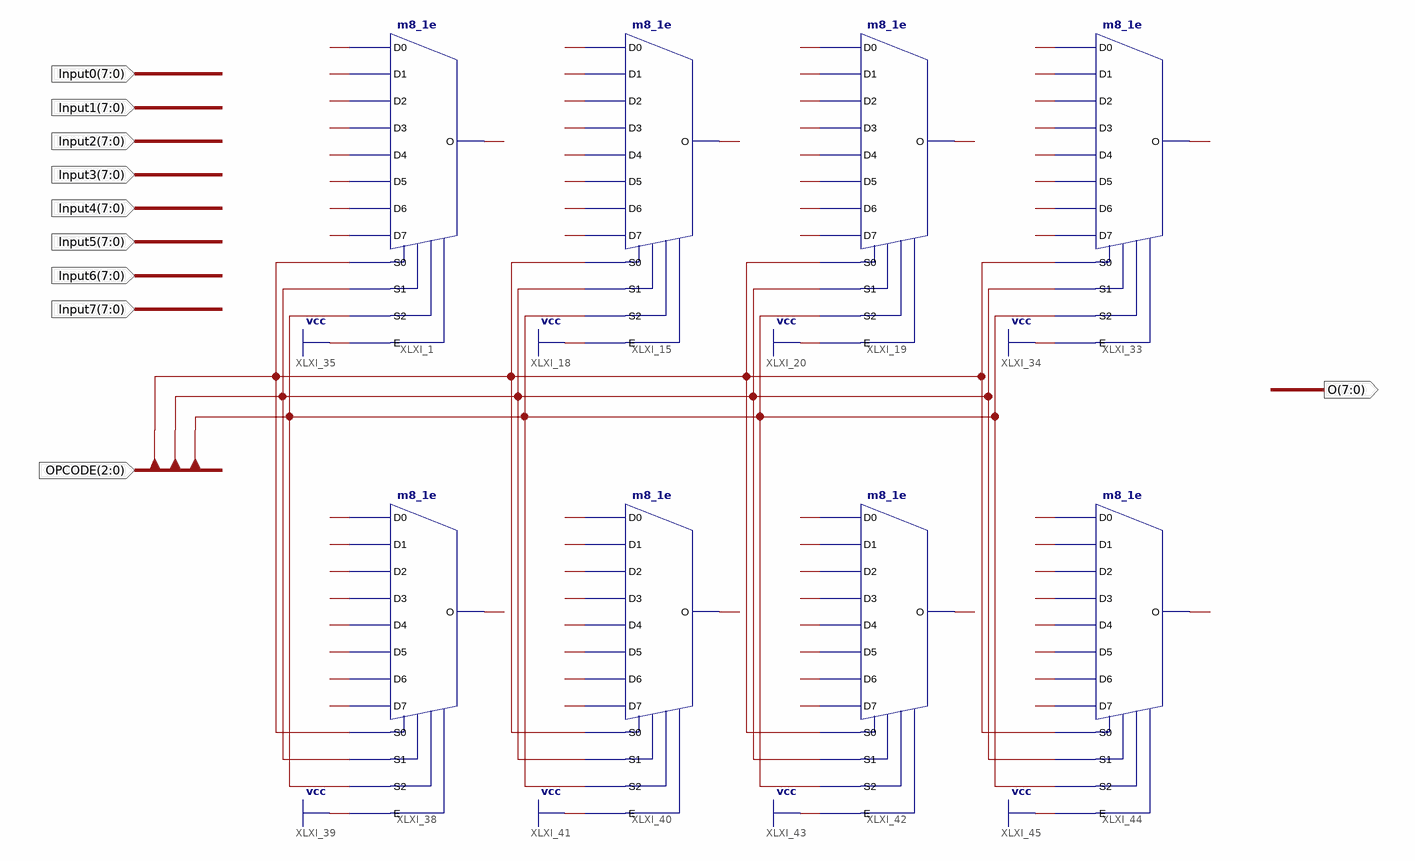
[diagram p0: schematic sheet 1]
// Xilinx ISE schematic eightBit8to1Mux.sch (spartan6) as structural Verilog: 8 symbols, 10 ports
module eightBit8to1Mux (
  input  [7:0] Input0,
  input  [7:0] Input1,
  input  [7:0] Input2,
  input  [7:0] Input4,
  input  [7:0] Input3,
  input  [7:0] Input5,
  input  [7:0] Input6,
  input  [7:0] Input7,
  input  [2:0] OPCODE,
  output [7:0] O
);

  m8_1e XLXI_15 (
    .D0(Input0[1]), .D1(Input1[1]), .D2(Input2[1]), .D3(Input3[1]), .D4(Input4[1]), .D5(Input5[1]),
    .D6(Input6[1]), .D7(Input7[1]), .E(1'b1), .S0(OPCODE[0]), .S1(OPCODE[1]), .S2(OPCODE[2]), .O(O[1]));
  m8_1e XLXI_1 (
    .D0(Input0[0]), .D1(Input1[0]), .D2(Input2[0]), .D3(Input3[0]), .D4(Input4[0]), .D5(Input5[0]),
    .D6(Input6[0]), .D7(Input7[0]), .E(1'b1), .S0(OPCODE[0]), .S1(OPCODE[1]), .S2(OPCODE[2]), .O(O[0]));
  m8_1e XLXI_38 (
    .D0(Input0[4]), .D1(Input1[4]), .D2(Input2[4]), .D3(Input3[4]), .D4(Input4[4]), .D5(Input5[4]),
    .D6(Input6[4]), .D7(Input7[4]), .E(1'b1), .S0(OPCODE[0]), .S1(OPCODE[1]), .S2(OPCODE[2]), .O(O[4]));
  m8_1e XLXI_40 (
    .D0(Input0[5]), .D1(Input1[5]), .D2(Input2[5]), .D3(Input3[5]), .D4(Input4[5]), .D5(Input5[5]),
    .D6(Input6[5]), .D7(Input7[5]), .E(1'b1), .S0(OPCODE[0]), .S1(OPCODE[1]), .S2(OPCODE[2]), .O(O[5]));
  m8_1e XLXI_42 (
    .D0(Input0[6]), .D1(Input1[6]), .D2(Input2[6]), .D3(Input3[6]), .D4(Input4[6]), .D5(Input5[6]),
    .D6(Input6[6]), .D7(Input7[6]), .E(1'b1), .S0(OPCODE[0]), .S1(OPCODE[1]), .S2(OPCODE[2]), .O(O[6]));
  m8_1e XLXI_44 (
    .D0(Input0[7]), .D1(Input1[7]), .D2(Input2[7]), .D3(Input3[7]), .D4(Input4[7]), .D5(Input5[7]),
    .D6(Input6[7]), .D7(Input7[7]), .E(1'b1), .S0(OPCODE[0]), .S1(OPCODE[1]), .S2(OPCODE[2]), .O(O[7]));
  m8_1e XLXI_19 (
    .D0(Input0[2]), .D1(Input1[2]), .D2(Input2[2]), .D3(Input3[2]), .D4(Input4[2]), .D5(Input5[2]),
    .D6(Input6[2]), .D7(Input7[2]), .E(1'b1), .S0(OPCODE[0]), .S1(OPCODE[1]), .S2(OPCODE[2]), .O(O[2]));
  m8_1e XLXI_33 (
    .D0(Input0[3]), .D1(Input1[3]), .D2(Input2[3]), .D3(Input3[3]), .D4(Input4[3]), .D5(Input5[3]),
    .D6(Input6[3]), .D7(Input7[3]), .E(1'b1), .S0(OPCODE[0]), .S1(OPCODE[1]), .S2(OPCODE[2]), .O(O[3]));
endmodule
